# Altium schematic sheet 02_POWER SUPPLY & USB &.SchDoc
size 420 x 297 mm
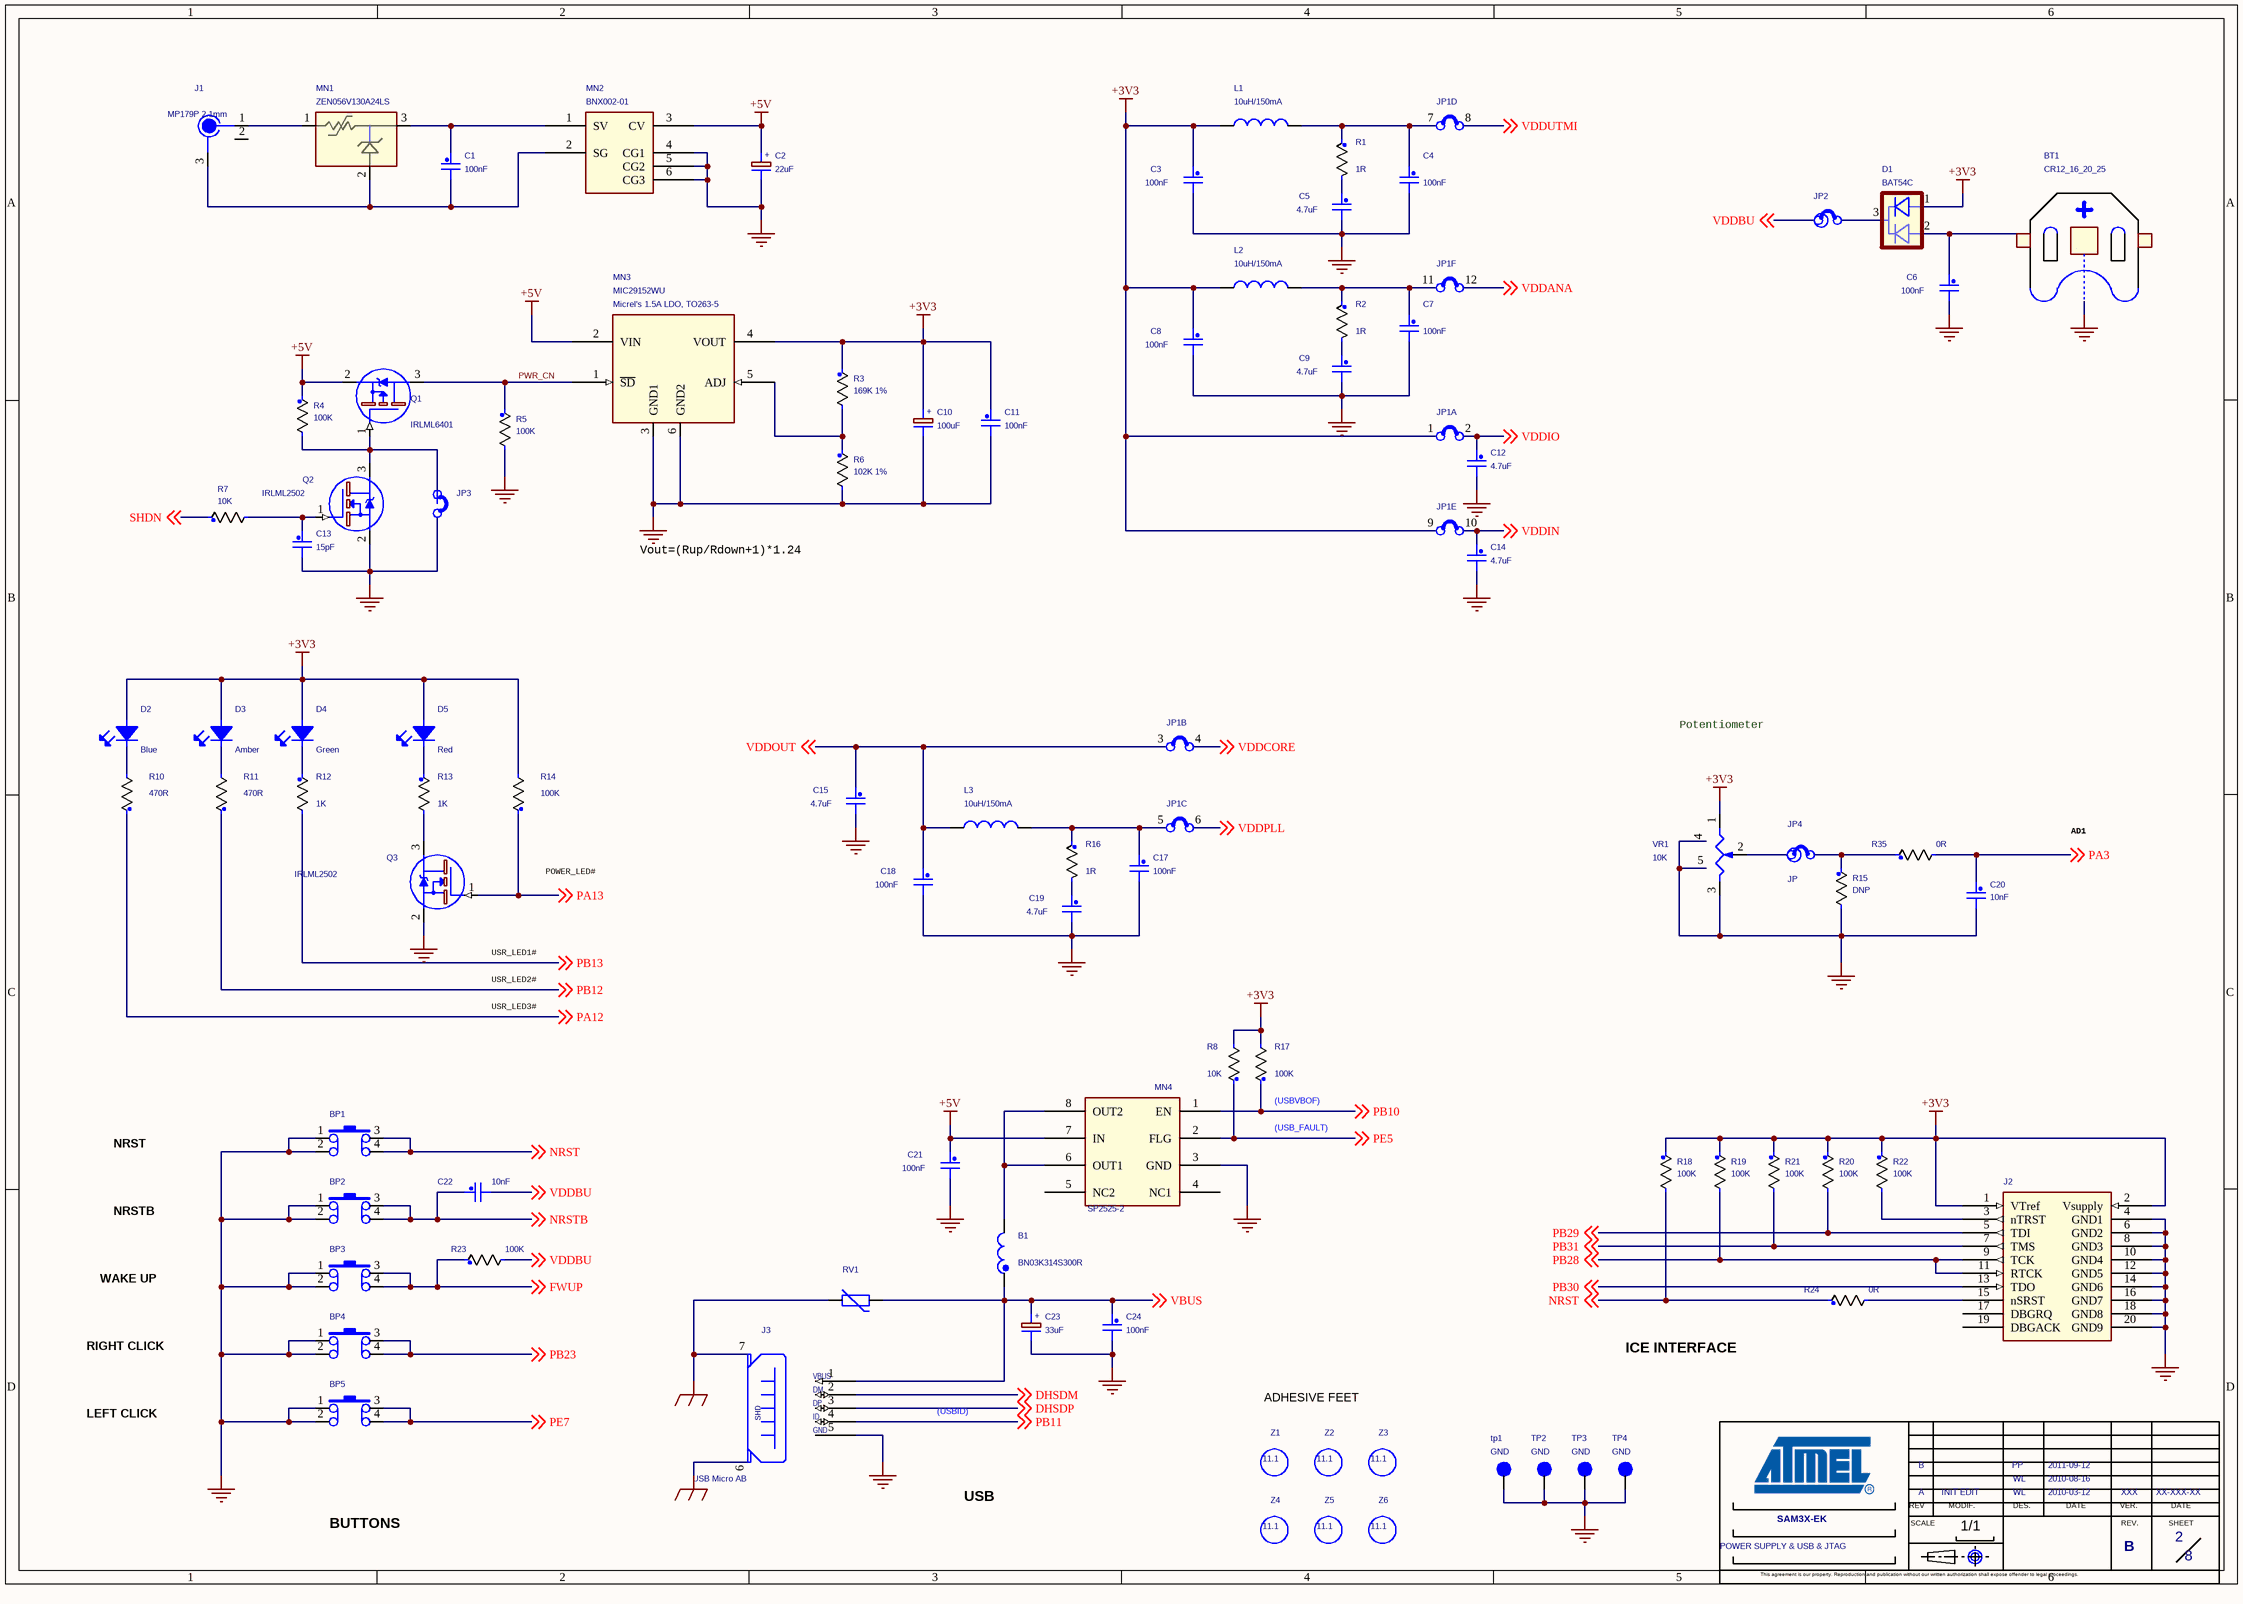
[diagram p0: 02_POWER SUPPLY & USB &.SchDoc]

## Parts
*  SHEET NAME 1: POWER SUPPLY & USB & JTAG  REV C: B  VERIF A: XXX  VERIF DATE A: XX-XXX-XX  Page Count: 8  Page Number: 2  DATE A: 2010-03-12  DATE B: 2010-08-16  DATE C: 2011-09-12  DES A: WL  DES C: PP  BOARD NAME: SAM3X-EK  VERSION: A  MODIF. DESCRIBE: INIT EDIT  (hidden comment: ATMEL ARM)  (graphical)
B1  BN03K314S300R  [R0603]
BP1  T062  [KEY]  (value not drawn)
BP2  T062  [KEY]  (value not drawn)
BP3  T062  [KEY]  (value not drawn)
BP4  T062  [KEY]  (value not drawn)
BP5  T062  [KEY]  (value not drawn)
BT1  CR12_16_20_25  [x-s_3000_01]
C1  100nF  [CAP0805]
C2  22uF  [C3528-21]
C3  100nF  [CAP0805]
C4  100nF  [CAP0805]
C5  4.7uF  [CAP0805]
C6  100nF  [CAP0805]
C7  100nF  [CAP0805]
C8  100nF  [CAP0805]
C9  4.7uF  [CAP0805]
C10  100uF  [C3528-21]
C11  100nF  [CAP0805]
C12  4.7uF  [CAP0805]
C13  15pF  [CAP0805]
C14  4.7uF  [CAP0805]
C15  4.7uF  [CAP0805]
C17  100nF  [CAP0805]
C18  100nF  [CAP0805]
C19  4.7uF  [CAP0805]
C20  10nF  [CAP0805]
C21  100nF  [CAP0805]
C22  10nF  [CAP0805]
C23  33uF  [C3528-21]
C24  100nF  [CAP0805]
D1  BAT54C  [SOT-23]
D2  Blue  [LED0805]
D3  Amber  [LED0805]
D4  Green  [LED0805]
D5  Red  [LED0805]
J1  VAL: MP179P 2.1mm  [CONNECT3PTS03]  (hidden comment: Jack MP179P 2.1mm)
J2  IDC20-2.54mm  [20PIN2]  (value not drawn)
J3  USB Micro AB  [usb_micro_ab]
JP1  SMT_JUMPER  [jms_tsm-2x6pts]  (value not drawn)  (parts A,B,C,D,E,F of 6)
JP2  JP  [BAR2PTS02]  (value not drawn)
JP3  JP  [BAR2PTS02]  (value not drawn)
JP4  JP  [BAR2PTS02]
L1  10uH/150mA  [NLFV25T]
L2  10uH/150mA  [NLFV25T]
L3  10uH/150mA  [NLFV25T]
MN1  ZEN056V130A24LS  [POLYZEN]
MN2  BNX002-01  [BNX001]
MN3  MIC29152WU  Note: Micrel's 1.5A LDO, TO263-5  [ADI/SM/TO263/5]
MN4  SP2525-2  [NSOIC8]
Q1  IRLML6401  [SOT23T02]
Q2  IRLML2502  [SOT23T02]
Q3  IRLML2502  [SOT23T02]
R1  1R  [R0603]
R2  1R  [R0603]
R3  169K 1%  [r0603]
R4  100K  [R0603]
R5  100K  [R0603]
R6  102K 1%  [r0603]
R7  10K  [R0603]
R8  10K  [R0603]
R10  470R  [R0603]
R11  470R  [R0603]
R12  1K  [r0603]
R13  1K  [r0603]
R14  100K  [R0603]
R15  DNP  [R0603]
R16  1R  [R0603]
R17  100K  [R0603]
R18  100K  [r0603]
R19  100K  [r0603]
R20  100K  [r0603]
R21  100K  [r0603]
R22  100K  [r0603]
R23  100K  [R0603]
R24  0R  [r0603]
R35  0R  [r0603]
RV1  VARISTOR_0603  [R0603]  (value not drawn)
SH1  Jumper Pitch 2.54  [JUMPER-2.54]  (value not drawn)
SH2  Jumper Pitch 2.54  [JUMPER-2.54]  (value not drawn)
SH3  Jumper Pitch 2.54  [JUMPER-2.54]  (value not drawn)
SH4  Jumper Pitch 2.54  [JUMPER-2.54]  (value not drawn)
SH5  Jumper Pitch 2.54  [JUMPER-2.54]  (value not drawn)
SH6  Jumper Pitch 2.54  [JUMPER-2.54]  (value not drawn)
SH8  Jumper Pitch 2.54  [JUMPER-2.54]  (value not drawn)
SH9  Jumper Pitch 2.54  [JUMPER-2.54]  (value not drawn)
SH10  Jumper Pitch 2.54  [JUMPER-2.54]  (value not drawn)
tp1  GND  [KST5012]
TP2  GND  [KST5012]
TP3  GND  [KST5012]
TP4  GND  [KST5012]
VR1  10K  [POT_3]
Z1  11.1  [TM6CIR3_2]
Z2  11.1  [TM6CIR3_2]
Z3  11.1  [TM6CIR3_2]
Z4  11.1  [TM6CIR3_2]
Z5  11.1  [TM6CIR3_2]
Z6  11.1  [TM6CIR3_2]

## Nets
+3V3: C3.1 C8.1 C10.1 C11.1 D1.1(K) D2.1(A) D3.1(A) D4.1(A) D5.1(A) J2.1(VTref) J2.2(Vsupply) JP1.1 JP1.9 L1.2 L2.2 MN3.4(VOUT) R3.1 R8.2 R14.2 R17.2 R18.1 R19.1 R20.1 R21.1 R22.1 VR1.1
+5V: C2.1 C21.1 MN2.3(CV) MN3.2(VIN) MN4.7(IN) Q1.2(S) R4.1
GND_EARTH: J3.6(SH1) J3.7(SH2) RV1.1
GND_POWER: BP1.1(T1) BP1.2(T2) BP2.1(T1) BP2.2(T2) BP3.1(T1) BP3.2(T2) BP4.1(T1) BP4.2(T2) BP5.1(T1) BP5.2(T2) BT1.1(M) C2.2 C3.2 C4.2 C5.2 C6.2 C7.2 C8.2 C9.2 C10.2 C11.2 C12.2 C13.2 C14.2 C15.2 C17.2 C18.2 C19.2 C20.2 C21.2 C23.2 C24.2 J2.4(GND1) J2.6(GND2) J2.8(GND3) J2.10(GND4) J2.12(GND5) J2.14(GND6) J2.16(GND7) J2.18(GND8) J2.20(GND9) J3.5(GND) JP3.2 MN2.4(CG1) MN2.5(CG2) MN2.6(CG3) MN3.3(GND1) MN3.6(GND2) MN4.3(GND) Q2.2(S) Q3.2(S) R5.2 R6.2 R15.2 tp1.1(TP) TP2.1(TP) TP3.1(TP) TP4.1(TP) VR1.3 VR1.4 VR1.5
DHSDM: J3.2(DM) ; off-sheet DHSDM
DHSDP: J3.3(DP) ; off-sheet DHSDP
FWUP: BP3.3(T3) BP3.4(T4) R23.1 ; off-sheet FWUP
NRST: BP1.3(T3) BP1.4(T4) R18.2 R24.1 ; off-sheet NRST
NRSTB: BP2.3(T3) BP2.4(T4) C22.1 ; off-sheet NRSTB
PA3: C20.1 R35.2 ; off-sheet PA3
PA12: R10.1 ; off-sheet PA12
PA13: Q3.1(G) R14.1 ; off-sheet PA13
PB10: MN4.1(EN) R17.1 ; off-sheet PB10
PB11: J3.4(ID) ; off-sheet PB11
PB12: R11.1 ; off-sheet PB12
PB13: R12.2 ; off-sheet PB13
PB23: BP4.3(T3) BP4.4(T4) ; off-sheet PB23
PB28: J2.9(TCK) J2.11(RTCK) R19.2 ; off-sheet PB28
PB29: J2.5(TDI) R20.2 ; off-sheet PB29
PB30: J2.13(TDO) ; off-sheet PB30
PB31: J2.7(TMS) R21.2 ; off-sheet PB31
PE5: MN4.2(FLG) R8.1 ; off-sheet PE5
PE7: BP5.3(T3) BP5.4(T4) ; off-sheet PE7
PWR_CN: MN3.1(~{SD}) Q1.3(D) R5.1
SHDN: R7.1 ; off-sheet SHDN
VBUS: B1.1 C23.1 C24.1 J3.1(VBUS) RV1.2 ; off-sheet VBUS
VDDANA: JP1.12 ; off-sheet VDDANA
VDDBU: C22.2 JP2.1 R23.2 ; off-sheet VDDBU
VDDCORE: JP1.4 ; off-sheet VDDCORE
VDDIN: C14.1 JP1.10 ; off-sheet VDDIN
VDDIO: C12.1 JP1.2 ; off-sheet VDDIO
VDDOUT: C15.1 C18.1 JP1.3 L3.2 ; off-sheet VDDOUT
VDDPLL: JP1.6 ; off-sheet VDDPLL
VDDUTMI: JP1.8 ; off-sheet VDDUTMI
NetB1_2: B1.2 MN4.6(OUT1) MN4.8(OUT2)
NetBT1_2: BT1.2(P1) C6.1 D1.2(A)
NetC1_1: C1.1 MN1.3(VOUT) MN2.1(SV)
NetC1_2: C1.2 J1.3 MN1.2(GND) MN2.2(SG)
NetC4_1: C4.1 JP1.7 L1.1 R1.1
NetC5_1: C5.1 R1.2
NetC7_1: C7.1 JP1.11 L2.1 R2.1
NetC9_1: C9.1 R2.2
NetC13_1: C13.1 Q2.1(G) R7.2
NetC17_1: C17.1 JP1.5 L3.1 R16.1
NetC19_1: C19.1 R16.2
NetD1_3: D1.3(COM) JP2.2
NetD2_2: D2.2(K) R10.2
NetD3_2: D3.2(K) R11.2
NetD4_2: D4.2(K) R12.1
NetD5_2: D5.2(K) R13.1
NetJ1_1: J1.1 MN1.1(VIN)
NetJ2_3: J2.3(nTRST) R22.2
NetJ2_15: J2.15(nSRST) R24.2
NetJP3_1: JP3.1 Q1.1(G) Q2.3(D) R4.2
NetJP4_1: JP4.1 VR1.2
NetJP4_2: JP4.2 R15.1 R35.1
NetMN3_5: MN3.5(ADJ) R3.2 R6.1
NetQ3_3: Q3.3(D) R13.2

Not connected (* = marked no-connect by the designer): BT1 3(P2); J1 2; J2 17(DBGRQ) 19(DBGACK); MN4 4(NC1) 5(NC2)

## Notes on the sheet
- Vout=(Rup/Rdown+1)*1.24
- Potentiometer
- AD1
- POWER_LED#
- (near Q3) USR_LED1#
- USR_LED2#
- USR_LED3#
- (near R17) (USBVBOF)
- (USB_FAULT)
- NRST
- NRSTB
- WAKE UP
- RIGHT CLICK
- ADHESIVE FEET
- ICE INTERFACE
- LEFT CLICK
- (USBID)
- BUTTONS
- USB
- (in symbol ATMEL ARM) REV; MODIF.; DES.; DATE; VER.; SCALE; REV.; SHEET; 1/1; This agreement is our property. Reproduction and publication without our written authorization shall expose offender to legal proceedings.
- (in symbol CAP_PN) +
- (in symbol USB_MicroAB) SHD

## Library data of the parts
* = ATMEL ARM: REV D: D; REV F: F; REV E: E; REV B: B; VERIF F: XXX; VERIF E: XXX; VERIF D: XXX; VERIF C: XXX; VERIF B: XXX; VERIF DATE F: XX-XXX-XX; VERIF DATE E: XX-XXX-XX; VERIF DATE D: XX-XXX-XX; VERIF DATE C: XX-XXX-XX; REV: B; VERIF DATE B: XX-XXX-XX; FT: ?; Page Size: A; Page Create Date: june 19, 2004; DATE D: XX-XXX-XX; DATE E: XX-XXX-XX; DATE F: XX-XXX-XX; DES E: XXX; DES F: XXX; DES B: WL; DES D: XXX
B1 = BEAD: FAB: GAUSSTEK GARP; DESIG: SMD EMI Suppression Ferrite Beads; BOI: 0603; VAL: BN03K314S300R; REF: BN03K314S300R
BP1-BP5 = B3S_2: VAL: T062-507; DEV: SWS_B3S_01; FAB: KALER; BOI: L=9 l=6.0 H=4.3; DESIG: Sealed surface mount tactile switch; REF: T062-507
BT1 = Battery Holder CR12_16_20_25: Part Number: 3UQTVB-18; REF: 3000; FAB: KEYSTONE; BOI: 01-Power
C1 C3 C8 C11 C17 C18 C21 C24 = C_Generic: Toler.: 10%; P/N #1: C0603C104K4RAC; Voltage: 16V; Mfg #1: KEMET; Dielectric: X7R; BOI: 0603; DESIG: Ceramic Capacitor; DEV: C0603; FAB: TDK; REF: C1608X7R1C104KT; VAL: 100nF; TEN: 16V; TOL: 10%
C2 = CAP_PN: SDTSourceLibName: C:\WINDOWS\TEMP\SNDS.LIB; Dielectric: X5R; TOL: 10%; TEN: 16V; REF: TPSB226K016R0400; FAB: AVX; DEV: 3528; DESIG: LOW ESR TANTALUM CAPACITOR; BOI: B; VAL: 22uF
C4 C6 C7 = C_Generic: Toler.: 10%; P/N #1: C0603C104K4RAC; Voltage: 16V; Mfg #1: KEMET; Dielectric: X7R; REF: C1608X7R1C104KT; FAB: TDK; DEV: C0603; DESIG: Ceramic Capacitor; BOI: 0603; TOL: 10%; TEN: 16V; VAL: 100nF
C5 C9 C19 = C_Generic: Toler.: 10%; P/N #1: C0603C104K4RAC; Voltage: 16V; Mfg #1: KEMET; Dielectric: X5R; BOI: 0805; DESIG: X5R CERAMIC CAPACITOR; DEV: C0805; FAB: TDK; REF: C2012X5R1C475KT; VAL: 4.7uF; TEN: 16V; TOL: 10%
C10 = CAP_PN: SDTSourceLibName: C:\WINDOWS\TEMP\SNDS.LIB; TOL: 10%; TEN: 6.3V; REF: TPSB107K006R0400; FAB: AVX; DEV: 3528; DESIG: LOW ESR TANTALUM CAPACITOR; BOI: B; Dielectric: X5R; VAL: 100uF
C12 C14 C15 = C_Generic: Toler.: 10%; P/N #1: C0603C104K4RAC; Voltage: 16V; Mfg #1: KEMET; Dielectric: X5R; REF: C2012X5R1C475KT; FAB: TDK; DEV: C0805; DESIG: X5R CERAMIC CAPACITOR; BOI: 0805; TOL: 10%; TEN: 16V; VAL: 4.7uF
C13 = C_Generic: Toler.: 10%; P/N #1: C0603C104K4RAC; Voltage: 50V; Mfg #1: KEMET; Dielectric: X7R; BOI: 0603; DESIG: Ceramic Capacitor; DEV: C0603; FAB: TDK; REF: C1608X7R1H150KT; TEN: 16V; VAL: 15pF; TOL: 10%
C20 C22 = C_Generic: Toler.: 10%; P/N #1: C0603C104K4RAC; Voltage: 16V; Mfg #1: KEMET; Dielectric: X7R; BOI: 0603; DESIG: Ceramic Capacitor; DEV: C0603; FAB: TDK; REF: C1608X7R1C103KT; VAL: 10nF; TEN: 16V; TOL: 10%
C23 = CAP_PN: SDTSourceLibName: C:\WINDOWS\TEMP\SNDS.LIB; Dielectric: X5R; TOL: 10%; TEN: 16V; REF: TPSB336K016R0500; FAB: AVX; DEV: 3528; DESIG: LOW ESR TANTALUM CAPACITOR; BOI: B; VAL: 33uF
D1 = BAT54C: BOI: SOT23; DESIG: SCHOKKTY DIODE; FAB: IRF; VAL: BAT54C; REF: BAT54C
D2 = LED_Small_1: Note: 0805; VAL: HSMB-C170; FAB: AVAGO; DESIG: Chip Led Green; REF: HSMB-C170; BOI: 0805
D3 = LED_Small_1: Note: 0805; VAL: HSMA-C170; FAB: AVAGO; DESIG: Chip Led Green; REF: HSMA-C170; BOI: 0805
D4 = LED_Small_1: Note: 0805; VAL: HSMG-C170; FAB: AVAGO; DESIG: Chip Led Green; REF: HSMG-C170; BOI: 0805
D5 = LED_Small_1: Note: 0805; VAL: HSMH-C170; FAB: AVAGO; DESIG: Chip Led Green; BOI: 0805; REF: HSMH-C170
J1 = Jack: FAB: SHENZHEN YUBO; DESIG: 2.1mm Power PCB Connector; REF: 065; BOI: 2.1mmD; DEV: CONNECT3PTS03
J2 = JTAG: VAL: HE10 20PTS; DESIG: 20 PIN 2.54mm BOX HEADER; FAB: SHENZHEN SITUO; REF: HE10 20PTS
J3 = USB_MicroAB: CON,USB Micro B; Manufacturer: Tyco; REF: 1981568-1; Manufacturer Part Number: 1981568-1; Part Type: Connector; FAB: Tyco
JP1 = SMT_JUMPER: REF: TSM-2*6; FAB: SAMTEC
JP2 JP3 = JUMP_0: VAL: 045; FAB: SHENZHEN SITUO; DESIG: 2.54mm Pin Header,Single Row,Straight/Right Angle(2pin); REF: 045
JP4 = JUMP_0: DESIG: 2.54mm Pin Header,Single Row,Straight/Right Angle(2pin); FAB: SHENZHEN SITUO; REF: 045; VAL: 045
L1-L3 = L_0: DESIG: Inductor; FAB: TDK; REF: NLFV25T-100K; VAL: 10uH/150mA
MN1 = ZEN056: FAB: TYCO; DESIG: Circuit Protection; VAL: ZEN056V130A24LS; REF: ZEN056V130A24LS
MN2 = BNX002_01: DESIG: EMI FILTER; FAB: MURATA; VAL: BNX002-01; REF: BNX002-01
MN3 = LP3965ES_ADJ: FAB: MICREL; DEV: TO-263-5; DESIG: High-Current Low-Dropout Regulator; Mfg #1: NATIONAL SEMI; P/N #1: LP3965ES-ADJ; VAL: MIC29152WU; REF: MIC29152WU; BOI: TO-263-5
MN4 = SP2525-SO8_1: FAB: Sipex; REF: SP2525-2EN
Q1 = IRLML6302: PUI: 0.4W; FAB: IRF; DEV: SOT23; DESIG: P-Channel MOSFET; VAL: IRLML6401; REF: IRLML6401; BOI: SOT23
Q2 Q3 = IRLML2402: BOI: SOT23; DESIG: N-Channel MOSFET; FAB: IRF; PUI: 0.4W; DEV: SOT23; REF: IRLML2502; VAL: IRLML2502
R1 R2 = R_Generic: P/N #1: CR10-1001F-T; TOL: 5%; REF: RC0603JR-071RL; FAB: YAGEO; DESIG: RC21 5%; BOI: 0603; VAL: 1R; DEV: R0603
R3 = R_Generic: P/N #1: CR10-1001F-T; BOI: 0603; DESIG: RC22H 1%; FAB: YAGEO; REF: RC0603FR-07330RL; VAL: 330R; DEV: R0603; TOL: 1%
R4 R14 R18 R21 R22 = R_Generic: P/N #1: CR10-1001F-T; BOI: 0603; DESIG: RC21 5%; FAB: YAGEO; REF: RC0603JR-07100KL; TOL: 5%; DEV: R0603; VAL: 100K
R5 R17 R19 R20 R23 = R_Generic: P/N #1: CR10-1001F-T; TOL: 5%; REF: RC0603JR-07100KL; FAB: YAGEO; DESIG: RC21 5%; BOI: 0603; VAL: 100K; DEV: R0603
R6 = R_Generic: P/N #1: CR10-1001F-T; VAL: 200R; REF: RC0603FR-07200RL; FAB: YAGEO; DESIG: RC22H 1%; BOI: 0603; TOL: 1%; DEV: R0603
R7 R8 = R_Generic: P/N #1: CR10-1001F-T; TOL: 5%; REF: RC0603JR-0710KL; FAB: YAGEO; DESIG: RC21 5%; BOI: 0603; VAL: 10K; DEV: R0603
R10 = R_Generic: P/N #1: CR10-1001F-T; BOI: 0603; DESIG: RC21 5%; FAB: YAGEO; REF: RC0603JR-07470RL; TOL: 5%; DEV: R0603; VAL: 470R
R11 = R_Generic: P/N #1: CR10-1001F-T; TOL: 5%; REF: RC0603JR-07470RL; FAB: YAGEO; DESIG: RC21 5%; BOI: 0603; VAL: 470R; DEV: R0603
R12 R13 = R_Generic: P/N #1: CR10-1001F-T; TOL: 5%; REF: RC0603JR-071KL; FAB: YAGEO; DESIG: RC21 5%; BOI: 0603; VAL: 1K; DEV: R0603
R15 = R_Generic: P/N #1: CR10-1001F-T; BOI: 0603; DESIG: RC22H 1%; FAB: YAGEO; REF: RC0603FR-0749R9L; VAL: 49.9R; TOL: 1%; DEV: R0603
R16 = R_Generic: P/N #1: CR10-1001F-T; BOI: 0603; DESIG: RC21 5%; FAB: YAGEO; REF: RC0603JR-071RL; TOL: 5%; DEV: R0603; VAL: 1R
R24 = R_Generic: P/N #1: CR10-1001F-T; TOL: 5%; REF: RC0603JR-070RL; FAB: YAGEO; DESIG: RC21 5%; BOI: 0603; VAL: 0R; DEV: R0603
R35 = R_Generic: P/N #1: CR10-1001F-T; BOI: 0603; DESIG: RC21 5%; FAB: YAGEO; REF: RC0603JR-070RL; TOL: 5%; DEV: R0603; VAL: 0R
RV1 = VARISTOR_0603: REF: V5.5MLA0603N; VAL: V5.5MLA0603; DESIG: transient voltage surge suppression devices; BOI: 0603; FAB: LITTELFUSE; REUSE_ANNOTATE: TRUE
SH1-SH3 SH5 SH6 SH8 SH10 = JUMPER-2.54: Jumper,2 Points Jumper Pitch 2.54; Part Number: 440-00002-1; Manufacturer: WIESON; Manufacturer Part Number: G4160-1A60BF1U; FAB: NA; REF: JUMPER 2.54; DESIG: 2 POINTS JUMPER PITCH 2.54; VAL: JUMPER 2.54; BOI: NA; Part Type: Jumper
SH4 SH9 = JUMPER-2.54: Jumper,2 Points Jumper Pitch 2.54; Manufacturer Part Number: G4160-1A60BF1U; Manufacturer: WIESON; Part Number: 440-00002-1; FAB: NA; REF: JUMPER 2.54; DESIG: 2 POINTS JUMPER PITCH 2.54; VAL: JUMPER 2.54; BOI: NA; Part Type: Jumper
tp1 TP3 = TP: REF: 5012; VAL: testing needle; FAB: keystone
TP2 TP4 = TP: FAB: keystone; VAL: testing needle; REF: 5012
VR1 = POT2: REF: WH9011-1-F; FAB: XINZE; DESIG: Potentiometer; VAL: 10K
Z1-Z6 = PIED ADHESIF 11.1mm: VAL: RBS-2; DESIG: BUMPERS; BOI: NA; FAB: RICHCO; RoHS: YES; REF: RBS-2